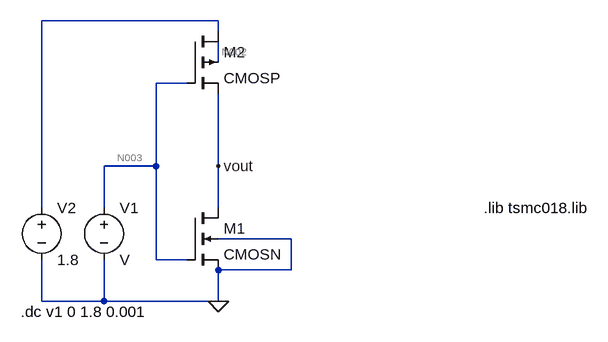
[diagram p0: schematic 180_switching.asc]
180_switching.asc, the LTspice schematic file:
Version 4
SHEET 1 1036 680
WIRE 224 -272 -48 -272
WIRE 224 -256 224 -272
WIRE 224 -208 224 -240
WIRE 176 -176 128 -176
WIRE 128 -48 128 -176
WIRE 128 -48 48 -48
WIRE 224 -48 224 -160
WIRE -48 16 -48 -272
WIRE 48 16 48 -48
WIRE 224 16 224 -48
WIRE 336 64 224 64
WIRE 128 96 128 -48
WIRE 176 96 128 96
WIRE 336 112 336 64
WIRE 336 112 224 112
WIRE -48 160 -48 96
WIRE 48 160 48 96
WIRE 48 160 -48 160
WIRE 224 160 224 112
WIRE 224 160 48 160
FLAG 224 -48 vout
FLAG 224 160 0
SYMBOL voltage 48 0 R0
SYMATTR InstName V1
SYMBOL voltage -48 0 R0
WINDOW 123 0 0 Left 0
WINDOW 39 0 0 Left 0
SYMATTR InstName V2
SYMATTR Value 1.8
SYMBOL cmosp 176 -256 R0
SYMATTR InstName M2
SYMATTR Value2 l=180n w=270n
SYMBOL cmosn 176 16 R0
SYMATTR InstName M1
SYMATTR Value2 l=180n w=270n
TEXT -80 176 Left 2 !.dc v1 0 1.8 0.001
TEXT 632 16 Left 2 !.lib tsmc018.lib

The netlist it stands for:
* 180_switching.asc
V1 N003 0 V
V2 N001 0 1.8
M2 N001 N003 vout N002 CMOSP l=180n w=270n
M1 vout N003 0 0 CMOSN l=180n w=270n
.model NMOS NMOS
.model PMOS PMOS
.lib standard.mos
.dc v1 0 1.8 0.001
.lib tsmc018.lib
.backanno
.end

* Results of the author's LTspice run, read from the files saved beside the schematic
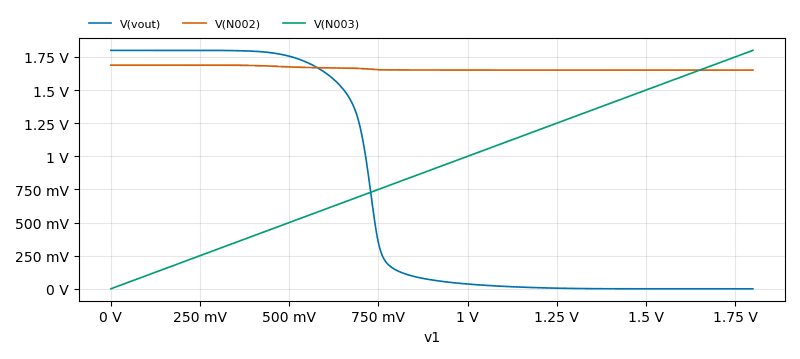
[diagram p1: DC transfer characteristic of 180_switching.asc, plotted from the saved traces]
* DC transfer characteristic, 1 run:
*   V(vout): 1.8 V at v1=0 V, 33.91 nV at v1=1.8 V, min 33.91 nV, max 1.8 V
*   V(N002): 1.689 V at v1=0 V, 1.651 V at v1=1.8 V, min 1.651 V, max 1.689 V
*   V(N003): 0 V at v1=0 V, 1.8 V at v1=1.8 V, min 0 V, max 1.8 V